# Altium schematic sheet PowerMeterV2.SchDoc
size A4
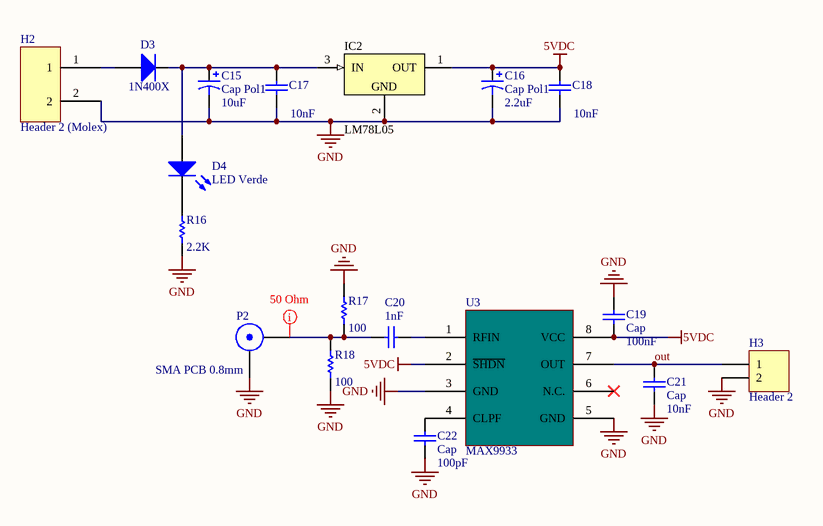
[diagram p0: PowerMeterV2.SchDoc]

## Parts
C15  Cap Pol1  value 10uF  [CAPPR2-5x11]
C16  Cap Pol1  value 2.2uF  [CAPPR2-5x11]
C17  value 10nF  [6-0805_L]
C18  value 10nF  [6-0805_L]
C19  Cap  value 100nF  [6-0805_L]
C20  value 1nF  [6-0805_L]
C21  Cap  value 10nF  [6-0805_L]
C22  Cap  value 100pF  [6-0805_L]
D3  1N400X  [MELF]
D4  LED Verde  [LED]
H2  Header 2 (Molex)  [Header 2 (Molex)]
H3  Header 2  [HDR1X2]
IC2  Nombre: LM78L05  [TO-92 (2)]  (hidden comment: 78Lxx)
P2  SMA PCB 0.8mm  [SMA PCB 0.8mm]
R16  value 2.2K  [6-0805_L]
R17  value 100  [6-0805_L]
R18  value 100  [6-0805_L]
U3  MAX9933  [8L uMAX]

## Nets
5VDC: C16.1 C18.2 C19.2 IC2.1(OUT) U3.2(~{SHDN}) U3.8(VCC)
GND: C15.2 C16.2 C17.1 C18.1 C19.1 C21.2 C22.2 H2.2 H3.2 IC2.2(GND) P2.2(Y) R16.1 R17.2 R18.1 U3.3(GND) U3.5(GND)
out: C21.1 H3.1 U3.7(OUT)
NetC15_1: C15.1 C17.2 D3.2(K) D4.1(A) IC2.3(IN)
NetC20_1: C20.1 P2.1(X) R17.1 R18.2
NetC20_2: C20.2 U3.1(RFIN)
NetC22_1: C22.1 U3.4(CLPF)
NetD3_1: D3.1(A) H2.1
NetD4_2: D4.2(K) R16.2

Not connected (* = marked no-connect by the designer): U3 6(N.C.)*

## Layout directives
net class 50 Ohm: NetC20_1

## Library data of the parts
C15 C16 = Cap Pol1: Polarized Capacitor (Radial); Published: 8-Jun-2000; LatestRevisionDate: 17-Jul-2002; LatestRevisionNote: Re-released for DXP Platform.; PackageReference: RB7.6-15; Publisher: Altium Limited
C17-C22 = Cap: Capacitor; Published: 8-Jun-2000; LatestRevisionDate: 17-Jul-2002; LatestRevisionNote: Re-released for DXP Platform.; PackageReference: RAD-0.3; Publisher: Altium Limited
  C19-C22: PackageDescription: Radial Cap, Thru-Hole; 2 Leads; 0.3 in Pin Spacing
D3 = Diode: Default Diode; Published: 8-Jun-2000; LatestRevisionDate: 17-Jul-2002; LatestRevisionNote: Re-released for DXP Platform.; PackageVersion: Sep-1996; PackageReference: SMC; Publisher: Altium Limited; Code_JEDEC: DO-214-AB
D4 = LED0: Typical INFRARED GaAs LED; Published: 8-Jun-2000; LatestRevisionDate: 08-Jul-2005; LatestRevisionNote: Mech Layer 1 removed.; PackageReference: LED-0; Publisher: Altium Limited
H2 = Header 2 (Molex): 2-Pin Header with Lock (0_100in pitch)
H3 = Header 2: Header, 2-Pin; LatestRevisionDate: 17-Jul-2002; LatestRevisionNote: Re-released for DXP Platform.; Publisher: Altium Limited
IC2 = 78Lxx: Regulador fijo de tensión positiva 100mA
R16-R18 = Res1: Resistor; Published: 8-Jun-2000; LatestRevisionDate: 17-Jul-2002; LatestRevisionNote: Re-released for DXP Platform.; PackageReference: AXIAL-0.3; Publisher: Altium Limited
U3 = MAX9933: RF LOG DETECTOR